# Altium schematic sheet DC SEPIC.SchDoc
size 297 x 209 mm; CompanyName: Sainsbury Wellcome Centre; Organization: FabLab; Address1: Sainsbury Wellcome Centre; Address2: 25 Howland Street; Address3: London; Address4: W1T 4JG; DocumentNumber: 8; SheetNumber: 8; SheetTotal: 14; swcgroup: FabLab; Org: Sainsbury Wellcome Centre; Add1: 25 Howland Street; Add2: London; Add3: W1T 4JG; WebAddress: www.sainsburywellcome.org; SheetSize: A4; SheetName: DC SEPIC
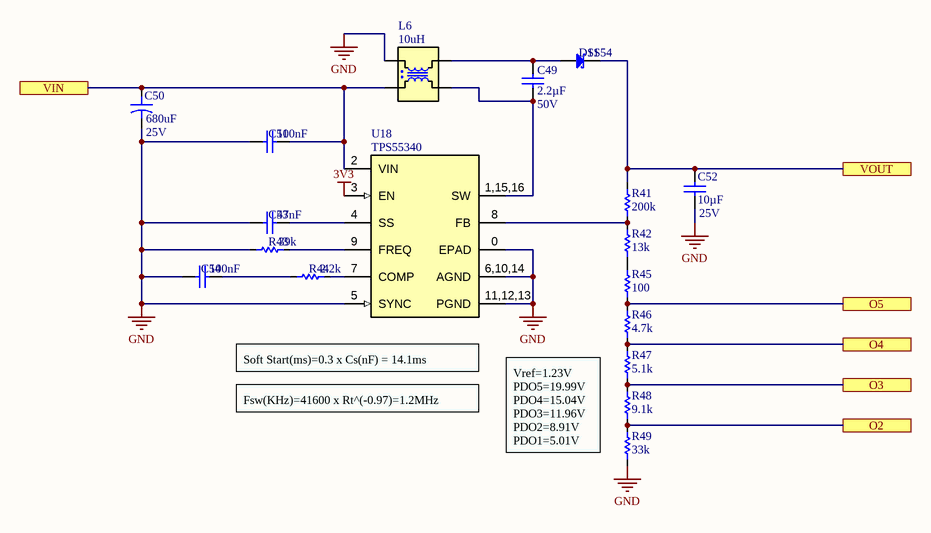
[diagram p0: DC SEPIC.SchDoc]

## Parts
C49  value 2.2µF  Voltage Rating: 50V  [CAP_CHIP_1210]  (hidden comment: C1210-2.2uF-50V)
C50  value 680uF  Voltage Rating: 25V  [ECAP_SMD_D8_10.2L]  (hidden comment: SC8-680uF-25V)
C51  value 100nF  [CAP_CHIP_0603]  (hidden comment: C0603-100nF-50V)
C52  value 10µF  Voltage Rating: 25V  [CAP_CHIP_0603]  (hidden comment: C0603-10uF-25V)
C53  value 47nF  [CAP_CHIP_0603]  (hidden comment: C0603-47nF-50V)
C54  value 100nF  [CAP_CHIP_0603]  (hidden comment: C0603-100nF-50V)
D11  SS54  [DO214AC/SMA]
L6  10uH  [IND_PWR_4P_1212]
R41  value 200k  [RES_CHIP_0603]  (hidden comment: R0603-200K)
R42  value 13k  [RES_CHIP_0603]  (hidden comment: R0603-13K)
R43  value 39k  [RES_CHIP_0603]  (hidden comment: R0603-39K)
R44  value 2.2k  [RES_CHIP_0603]  (hidden comment: R0603-2K2)
R45  value 100  [RES_CHIP_0603]  (hidden comment: R0603-100R)
R46  value 4.7k  [RES_CHIP_0603]  (hidden comment: R0603-4K7)
R47  value 5.1k  [RES_CHIP_0603]  (hidden comment: R0603-5K1)
R48  value 9.1k  [RES_CHIP_0603]  (hidden comment: R0603-9K1)
R49  value 33k  [RES_CHIP_0603]  (hidden comment: R0603-33K)
U18  TPS55340  [WQFN16_3X3_0.5E]

## Ports
O2, O3, O4, O5, VIN, VOUT

## Nets
3V3: U18.3(EN)
GND: C50.2 C51.2 C52.1 C53.1 C54.2 L6.2 R43.1 R49.1 U18.0(EPAD) U18.5(SYNC) U18.6,10,14(AGND) U18.11,12,13(PGND)
O2: R48.1 R49.2 ; port O2
O3: R47.1 R48.2 ; port O3
O4: R46.1 R47.2 ; port O4
O5: R45.1 R46.2 ; port O5
VIN: C50.1 C51.1 L6.1 U18.2(VIN) ; port VIN
VOUT: C52.2 D11.1(C) R41.2 ; port VOUT
NetC49_1: C49.1 D11.2(A) L6.4
NetC49_2: C49.2 L6.3 U18.1,15,16(SW)
NetC53_2: C53.2 U18.4(SS)
NetC54_1: C54.1 R44.2
NetR41_1: R41.1 R42.2 U18.8(FB)
NetR42_1: R42.1 R45.2
NetR43_2: R43.2 U18.9(FREQ)
NetR44_1: R44.1 U18.7(COMP)

## Notes on the sheet
- Fsw(KHz)=41600 x Rt^(-0.97)=1.2MHz
- (near U18) Soft Start(ms)=0.3 x Cs(nF) = 14.1ms
- Vref=1.23V
  PDO5=19.99V
  PDO4=15.04V
  PDO3=11.96V
  PDO2=8.91V
  PDO1=5.01V
- FILE
- VARIANT
- DATE
- REVISION
- SHEET
- /
- PROJECT
- SIZE

## Library data of the parts
C49 = CMP-611-0036-5: 1210 Multilayer Ceramic Capacitors MLCC; PartNumber: 1210B225K500NT; Dielectric: X7R; Pick&PlaceFootprint: C1210; Tolerance: 10%; LCSC Part N.: C1950; Case/Package: 1210; Mount: Surface Mount; Capacitor Type: Ceramic; RoHS: Yes
C50 = CMP-610-0010-1: 25V 680uF ±20% SMD,D8xL10.5mm Solid Capacitors; PartNumber: HV1E687M0810PZ; Pick&PlaceFootprint: EC8; ESR (Equivalent Series Resistance): 25mR; Capacitor Type: Solid; LCSC Part N.: C5246549; Tolerance: 20%; RoHS: Yes; Mount: Surface Mount
C51 C54 = CMP-611-0027-24: 0603 Multilayer Ceramic Capacitors MLCC; PartNumber: CC0603KRX7R9BB104; Tolerance: 10%; Pick&PlaceFootprint: C0603; Dielectric: X7R; Voltage Rating: 50V; Capacitor Type: Ceramic; RoHS: Yes; Mount: SMD; LCSC Part N.: C14663; Case/Package: 0603
C52 = CMP-611-0050-6: 0603 Multilayer Ceramic Capacitors MLCC; PartNumber: CL10A106MA8NRNC; Dielectric: X5R; Pick&PlaceFootprint: C0603; Tolerance: 20%; Case/Package: 0603; LCSC Part N.: C96446; RoHS: Yes; Capacitor Type: Ceramic; Mount: SMD
C53 = CMP-611-0073-1: 0603 Multilayer Ceramic Capacitors MLCC; PartNumber: CL10B473KB8NNNC; Tolerance: 10%; Pick&PlaceFootprint: C0603; Voltage Rating: 50V; Dielectric: X7R; Mount: SMD; LCSC Part N.: C1622; Case/Package: 0603; RoHS: Yes; Capacitor Type: Ceramic
D11 = CMP-821-0012-2: 40V 550mV@5A 5A SMA(DO-214AC) Schottky Barrier Diodes (SBD); Forward Voltage: 550mV; Rectified Current: 5A; PartNumber: SS54; Pick&PlaceFootprint: SMA; LCSC Part N.: C22452; Mount: Surface Mount; Max Reverse Voltage: 40V
L6 = CMP-620-0011-4: Ind Power Shielded Wirewound 10uH/40uH 20% 100KHz Ferrite 5.35A/2.67A T/R; PartNumber: SRF1260-100M; RMS Current (Irms): 5.35A; DC Resistance (DCR): 24mR; Saturation Current: 7.17A; Tolerance: 20%; LCSC Part N.: C7084460; Value: 10uH
R41 = CMP-633-0101-12: 100mW Thick Film Resistors 75V ±100ppm/℃ ±1% 0603 Chip Resistor; PartNumber: 0603WAF2003T5E; Pick&PlaceFootprint: R0603; Number of Resistors: 1; Case/Package: 0603; Voltage Rating: 75V; LCSC Part N.: C25811; Mount: Surface Mount; Tolerance: 1%; Power Rating: 100mW
R42 = CMP-633-0102-11: 100mW Thick Film Resistors 75V ±100ppm/℃ ±1% 0603 Chip Resistor; PartNumber: 0603WAF1302T5E; Pick&PlaceFootprint: R0603; Number of Resistors: 1; Mount: Surface Mount; Voltage Rating: 75V; Case/Package: 0603; Power Rating: 100mW; Tolerance: 1%; LCSC Part N.: C22797
R43 = CMP-633-0119-5: 100mW Thick Film Resistors 75V ±100ppm/℃ ±1% 0603 Chip Resistor; PartNumber: 0603WAF3902T5E; Pick&PlaceFootprint: R0603; Number of Resistors: 1; Tolerance: 1%; LCSC Part N.: C23153; Case/Package: 0603; Voltage Rating: 75V; Power Rating: 100mW; Mount: Surface Mount
R44 = CMP-633-0070-21: 100mW Thick Film Resistors 75V ±100ppm/℃ ±1% 0603 Chip Resistor; PartNumber: 0603WAF2201T5E; Pick&PlaceFootprint: R0603; Number of Resistors: 1; Power Rating: 100mW; Mount: Surface Mount; Voltage Rating: 75V; Tolerance: 1%; LCSC Part N.: C4190; Case/Package: 0603
R45 = CMP-633-0094-12: 100mW Thick Film Resistors 75V ±100ppm/℃ ±1% 0603 Chip Resistor; PartNumber: 0603WAF1000T5E; Number of Resistors: 1; Pick&PlaceFootprint: R0603; Case/Package: 0603; Voltage Rating: 75V; Mount: Surface Mount; Tolerance: 1%; LCSC Part N.: C22775; Power Rating: 100mW
R46 = CMP-633-0024-26: 100mW Thick Film Resistors 75V ±100ppm/℃ ±1% 0603 Chip Resistor; PartNumber: 0603WAF4701T5E; Pick&PlaceFootprint: R0603; Number of Resistors: 1; Case/Package: 0603; Voltage Rating: 75V; Tolerance: 1%; Power Rating: 100mW; LCSC Part N.: C23162; Mount: Surface Mount
R47 = CMP-633-0090-12: 100mW Thick Film Resistors 75V ±100ppm/℃ ±1% 0603 Chip Resistor; PartNumber: 0603WAF5101T5E; Number of Resistors: 1; Pick&PlaceFootprint: R0603; Voltage Rating: 75V; Case/Package: 0603; Power Rating: 100mW; Tolerance: 1%; LCSC Part N.: C23186; Mount: Surface Mount
R48 = CMP-633-0113-5: 100mW Thick Film Resistors 75V ±100ppm/℃ ±1% 0603 Chip Resistor; PartNumber: 0603WAF9101T5E; Pick&PlaceFootprint: R0603; Number of Resistors: 1; Power Rating: 100mW; Mount: Surface Mount; Tolerance: 1%; Voltage Rating: 75V; Case/Package: 0603; LCSC Part N.: C23260
R49 = CMP-633-0105-10: 100mW Thick Film Resistors 75V ±100ppm/℃ ±1% 0603 Chip Resistor; PartNumber: 0603WAF3302T5E; Pick&PlaceFootprint: R0603; Number of Resistors: 1; Tolerance: 1%; Mount: Surface Mount; Voltage Rating: 75V; LCSC Part N.: C4216; Case/Package: 0603; Power Rating: 100mW
U18 = CMP-970-0061-2: 5-A, 40-V, wide VIN boost, flyback, & SEPIC converter 16-WQFN -40 to 150; PartNumber: TPS55340RTER; Max Output Voltage: 38V; Max Output current: 5A; Switching Frequency: 1.14MHz; Reference Voltage: 1.229V; Max Input Voltage: 32V; RDS(On): 120mR; Min Input Voltage: 2.9V; LCSC Part N.: C169167; Switcher Configuration: Boost